# EAGLE design circuit (EAGLE 9.6.2)
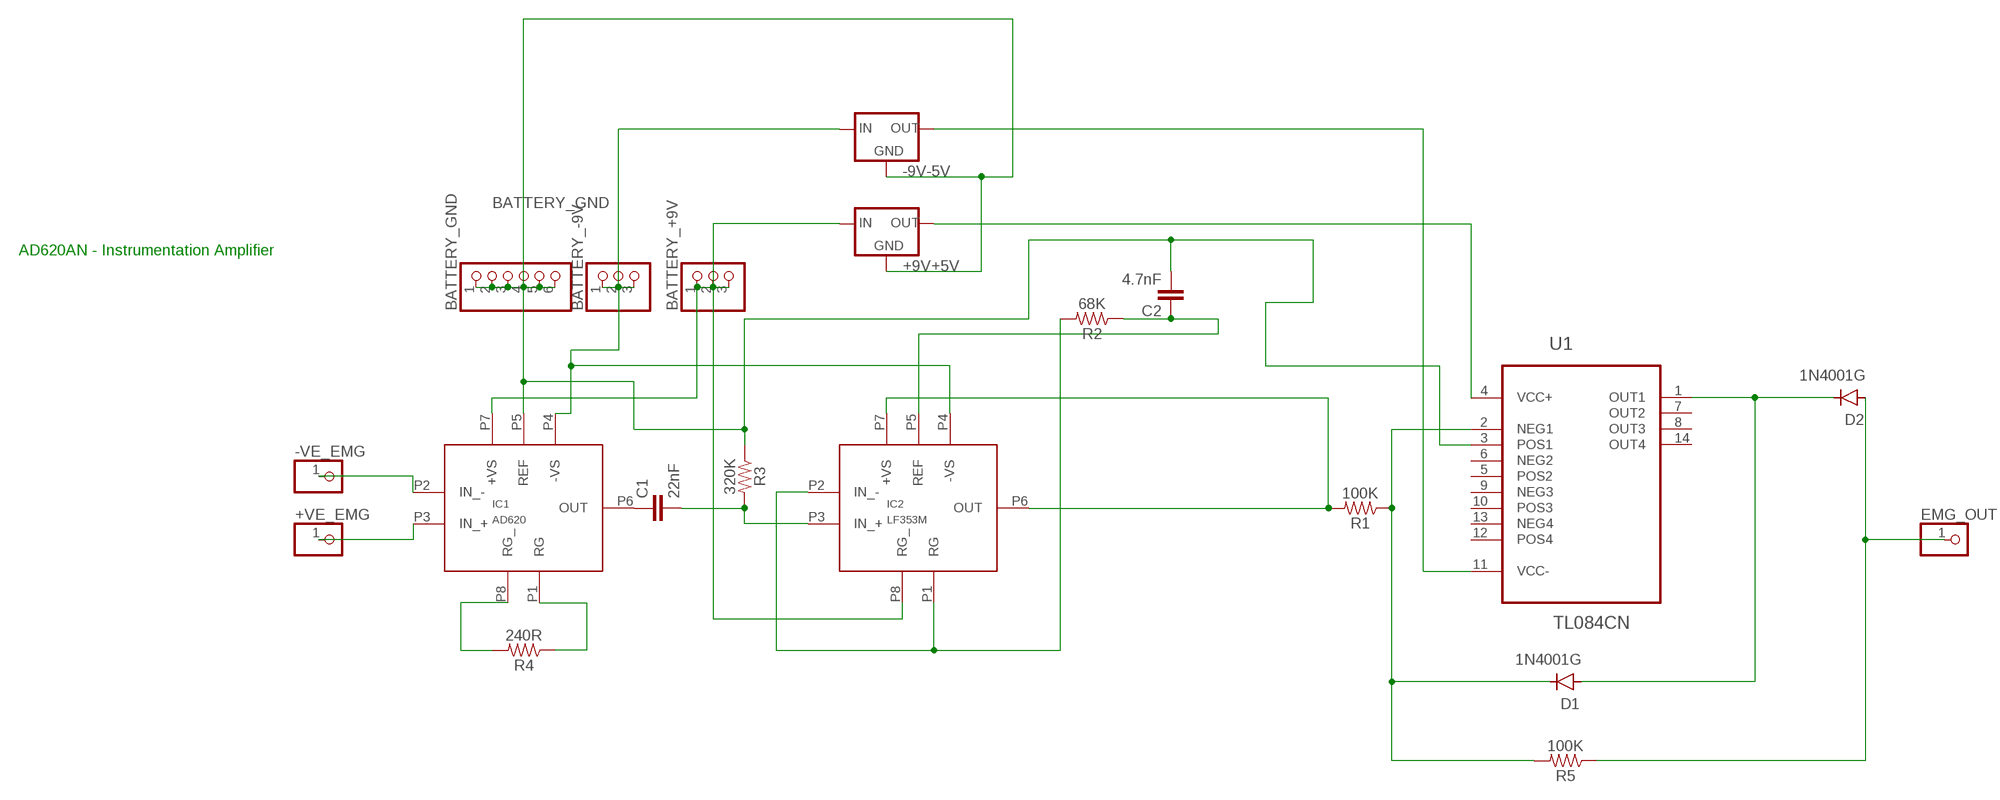
[diagram p0: schematic, sheet 1]

## Parts
+9V+5V  78XXL  [78XXL]
+VE_EMG  PINHD-1X1  [1X01]
-9V-5V  78XXL  [78XXL]
-VE_EMG  PINHD-1X1  [1X01]
BATTERY_+9V  PINHD-1X3  [1X03]
BATTERY_-9V  PINHD-1X3  [1X03]
BATTERY_GND  PINHD-1X6  [1X06]
C1  22nF  10NF-PTH-10MM-10000V-1-%  [CAP-PTH-10MM]
C2  4.7nF  10NF-PTH-10MM-10000V-1-%  [CAP-PTH-10MM]
D1  1N4001G  1N4004  [DO-41]
D2  1N4001G  1N4004  [DO-41]
EMG_OUT  PINHD-1X1  [1X01]
IC1  AD620  [DIL8]
IC2  LF353M  AD620  [DIL8]
R1  100K  10MOHM-HORIZ-1/4W-5%  [AXIAL-0.3]
R2  68K  10MOHM-HORIZ-1/4W-5%  [AXIAL-0.3]
R3  320K  10MOHM-HORIZ-1/4W-5%  [AXIAL-0.3]
R4  240R  10MOHM-HORIZ-1/4W-5%  [AXIAL-0.3]
R5  100K  10MOHM-HORIZ-1/4W-5%  [AXIAL-0.3]
U1  TL084CN  [DIP254P762X510-14]

## Nets
BATTERY_GND: +9V+5V.GND -9V-5V.GND BATTERY_GND.1 BATTERY_GND.2 BATTERY_GND.3 BATTERY_GND.4 BATTERY_GND.5 BATTERY_GND.6 C2.2 IC1.P5(REF) R3.P$1 U1.3(POS1)
N$1: IC1.P8(RG_) R4.P$2
N$2: IC1.P1(RG) R4.P$1
N$3: +VE_EMG.1 IC1.P3(IN_+)
N$4: -VE_EMG.1 IC1.P2(IN_-)
N$5: +9V+5V.IN BATTERY_+9V.1 BATTERY_+9V.2 BATTERY_+9V.3 IC1.P7(+VS) IC2.P8(RG_)
N$6: C1.1 IC1.P6(OUT)
N$7: D1.C R1.P$1 R5.P$2 U1.2(NEG1)
N$8: C1.2 IC2.P3(IN_+) R3.P$2
N$9: IC2.P1(RG) IC2.P2(IN_-) R2.P$2
N$10: C2.1 IC2.P5(REF) R2.P$1
N$11: IC2.P6(OUT) IC2.P7(+VS) R1.P$2
N$12: D1.A D2.C U1.1(OUT1)
N$13: +9V+5V.OUT U1.4(VCC+)
N$14: -9V-5V.OUT U1.11(VCC-)
N$15: D2.A EMG_OUT.1 R5.P$1
N$99: -9V-5V.IN BATTERY_-9V.1 BATTERY_-9V.2 BATTERY_-9V.3 IC1.P4(-VS) IC2.P4(-VS)
Unconnected: U1.5(POS2) U1.6(NEG2) U1.7(OUT2) U1.8(OUT3) U1.9(NEG3) U1.10(POS3) U1.12(POS4) U1.13(NEG4) U1.14(OUT4)

## Notes on the sheet
- AD620AN - Instrumentation Amplifier

## Library data of the parts
+9V+5V -9V-5V = v-reg-2:78XXL: VOLTAGE REGULATOR
+VE_EMG -VE_EMG EMG_OUT = adafruit:PINHD-1X1: Pin header 1x1 for 0.1" spacing With round pins
BATTERY_+9V BATTERY_-9V = adafruit:PINHD-1X3: PIN HEADER
BATTERY_GND = adafruit:PINHD-1X6: PIN HEADER
C1 C2 = SparkFun-Capacitors:10NF: 0.01uF/10nF/10,000pF ceramic capacitors A capacitor is a passive two-terminal electrical component used to store electrical energy temporarily in an electric field. CAP-09321; PROD_ID: CAP-09321; VALUE: 10nF
D1 D2 = Diodes:1N4004: DIODE GEN PURP 400V 1A DO41 Manufacturer's datasheet <https://www.mccsemi.com/pdf/Products/1N4001-1N4007(DO-41).pdf>; CREATED_BY: PCBLayout.com; DIGIKEY_PART_NUMBER: 1N4004MSCT-ND; MANUFACTURER: Micro Commercial Co; MPN: 1N4004; PACKAGE: DO-41
IC1 IC2 = ad620:AD620
R1-R5 = SparkFun-Resistors:10MOHM: RES-09327; PROD_ID: RES-09327; VALUE: 10M
U1 = TL084CN:TL084CN: JFET quad operational amplifiers Check prices <https://pricing.snapeda.com/parts/TL084CN/STMicroelectronics/view-part?ref=eda>; AVAILABILITY: Warning; DESCRIPTION: J-FET Amplifier 4 Circuit 14-DIP; MF: STMicroelectronics; MP: TL084CN; PACKAGE: DIP-14 STMicroelectronics; PRICE: None; PURCHASE-URL: https://pricing.snapeda.com/search/part/TL084CN/?ref=eda

## Board
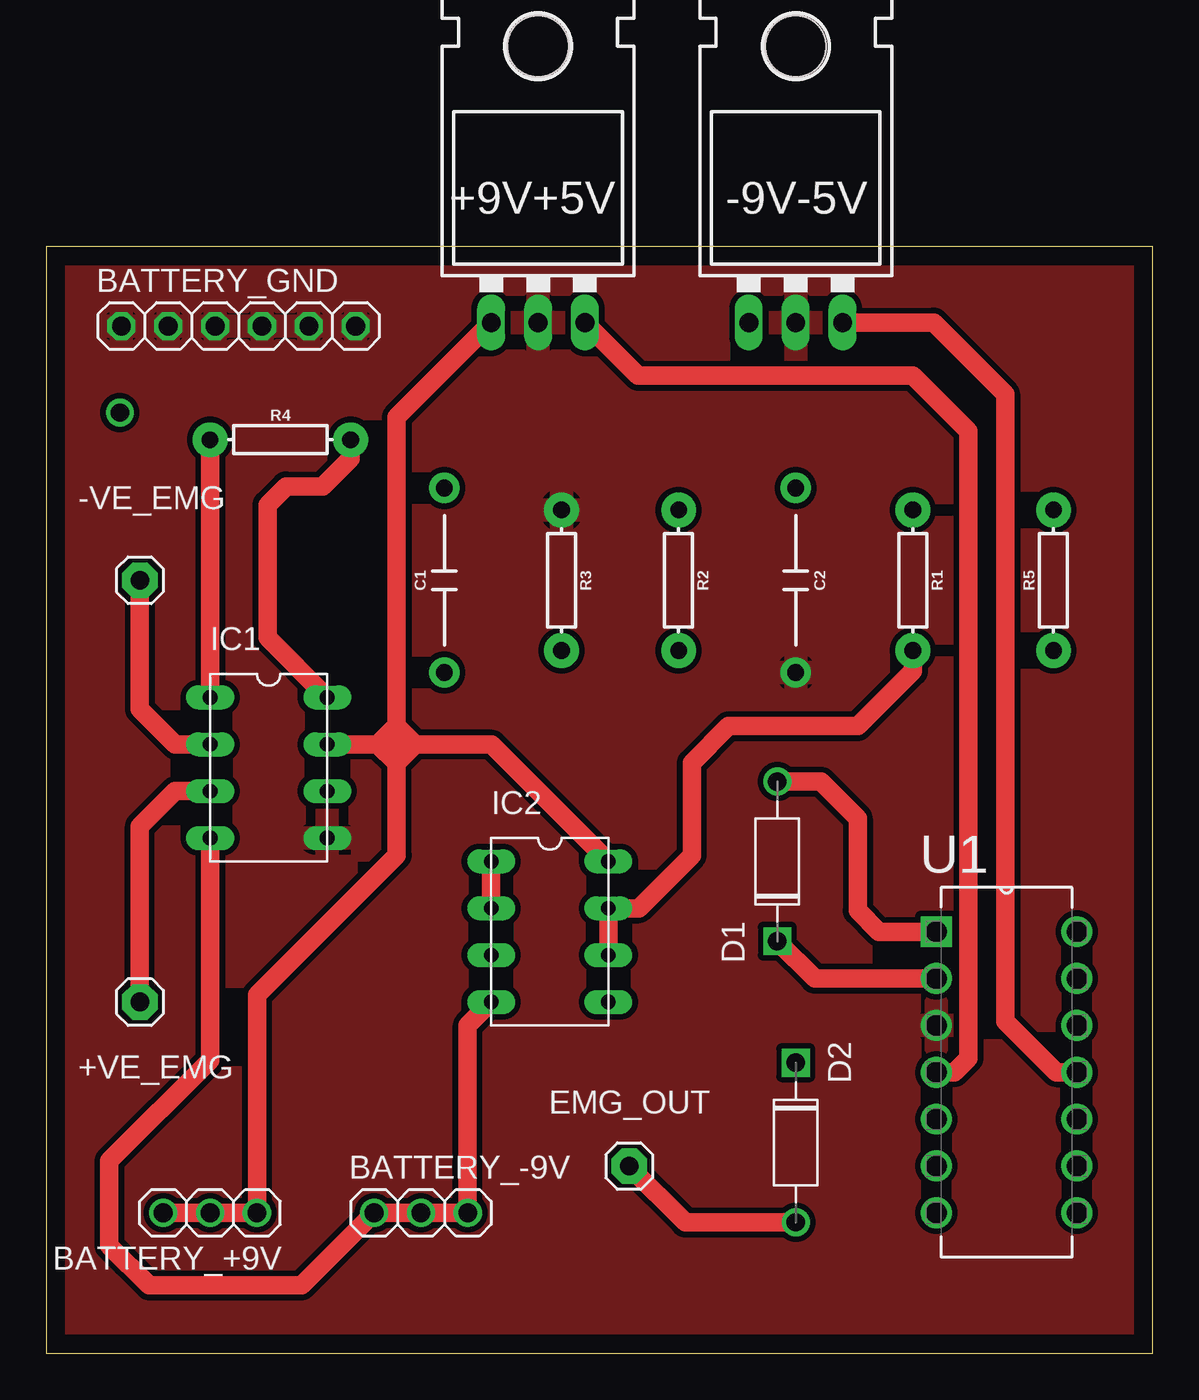
[diagram p1: board, top side]
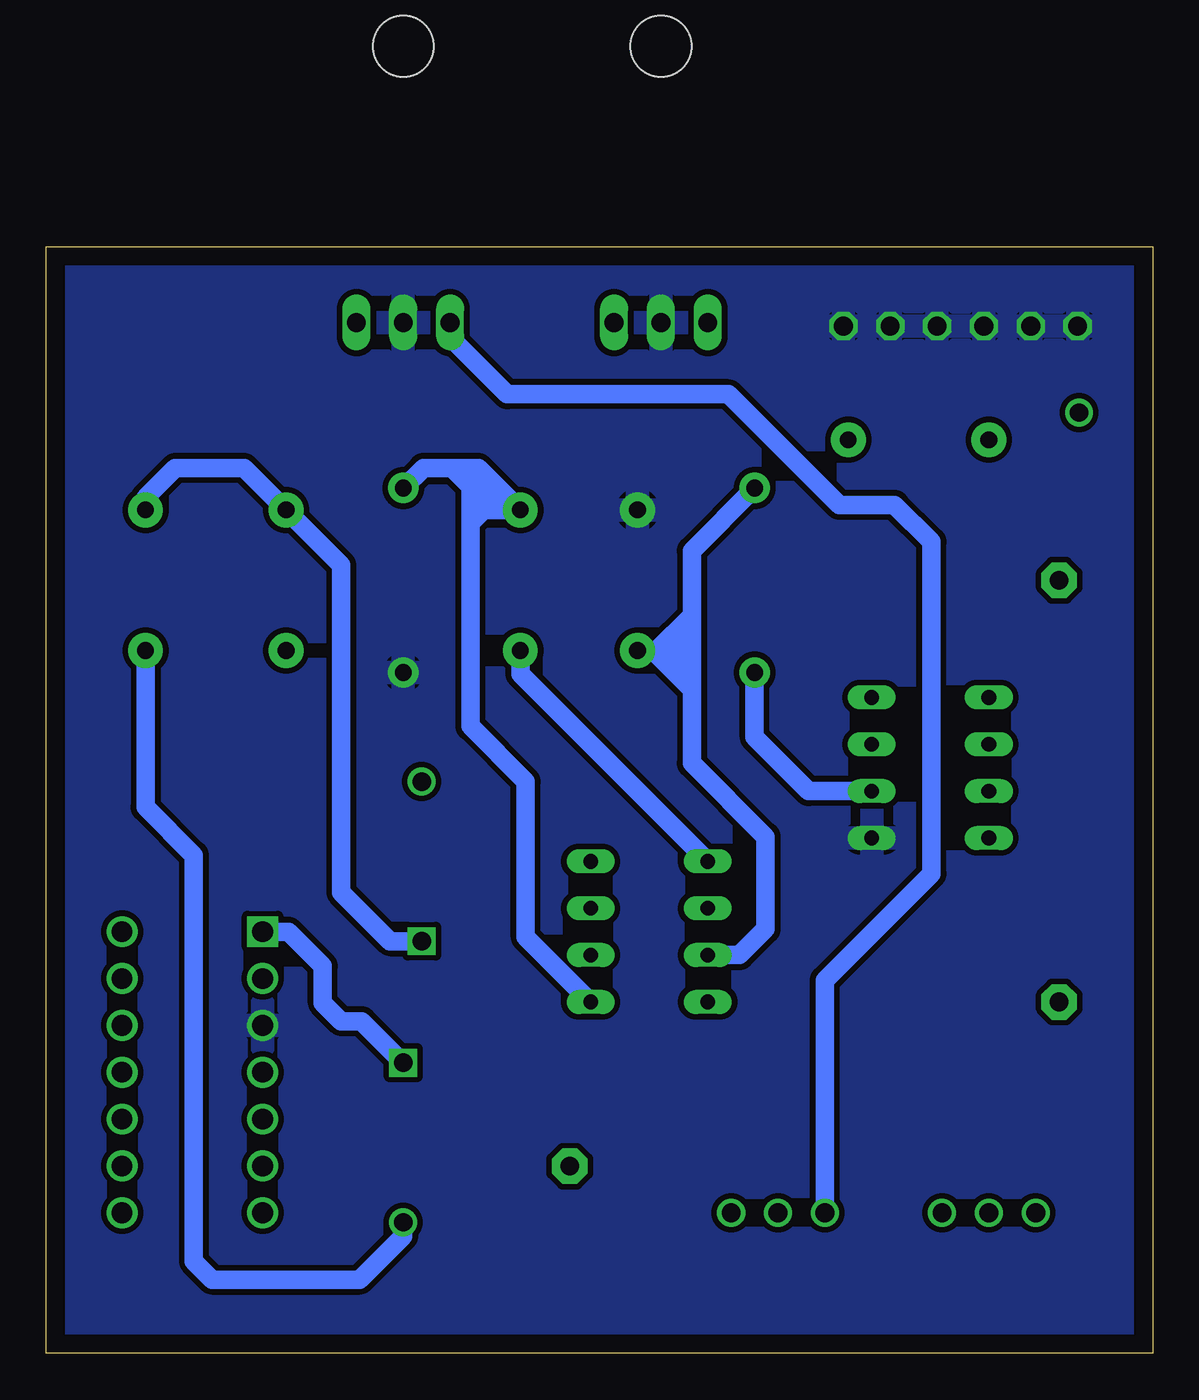
[diagram p2: board, bottom side, seen from below]

Size 60 x 60 mm. Coordinates in mm from the lower left corner, seen from the top.
Outline: 0,0 60,0 60,60 0,60 0,0
Copper layers (1*16): Top 0.035mm / dielectric 1.5mm / Bottom 0.035mm
Design rules "default *": minimum track width 6mil, minimum drill 0.35mm, track to track 6mil, track to pad 6mil, pad to pad 6mil, via to via 6mil, smd to smd 30mil, copper to edge 40mil, drill to drill 6mil, minimum pad ring 10mil, minimum via ring 8mil, stop-mask expansion 4mil, vias tented up to drill 0mil, thermal gap 10mil

### Footprints (pad centres in the part's own frame; a part is rotated, then mirrored left to right if it is on the bottom)
78XXL = drill 1.016 long: GND 0,-3.81; IN -2.54,-3.81; OUT 2.54,-3.81 | hole 3.302: 0,11.176
1X01 = drill 1.016 pad 1.93 octagon: 1 0,0
1X03 = drill 1.016: 1 -2.54,0; 2 0,0; 3 2.54,0
1X06 = drill 1.016 octagon: 1 -6.35,0; 2 -3.81,0; 3 -1.27,0; 4 1.27,0; 5 3.81,0; 6 6.35,0
CAP-PTH-10MM = drill 0.9 pad 1.651: 1 -5,0; 2 5,0
DO-41 = drill 1: A 4.325,0 | drill 1 square: C -4.325,0
DIL8 = drill 0.8 long: P1 -3.81,2.54; P2 -1.27,2.54; P3 1.27,2.54; P4 3.81,2.54; P5 3.81,8.89; P6 1.27,8.89; P7 -1.27,8.89; P8 -3.81,8.89
AXIAL-0.3 = drill 0.9 pad 1.88: P$1 -3.81,0; P$2 3.81,0
DIP254P762X510-14 = drill 1.118 square: 1 -7.62,15.24 | drill 1.118: 2 -7.62,12.7; 3 -7.62,10.16; 4 -7.62,7.62; 5 -7.62,5.08; 6 -7.62,2.54; 7 -7.62,0; 8 0,0; 9 0,2.54; 10 0,5.08; 11 0,7.62; 12 0,10.16; 13 0,12.7; 14 0,15.24

### Placement (x,y rotation side)
+9V+5V  26.67,59.69 0 top
+VE_EMG  5.08,19.05 0 top
-9V-5V  40.64,59.69 0 top
-VE_EMG  5.08,41.91 0 top
BATTERY_+9V  8.89,7.62 180 top
BATTERY_-9V  20.32,7.62 0 top
BATTERY_GND  10.43,55.69 0 top
C1  21.59,41.91 90 top
C2  40.64,41.91 270 top
D1  39.64,26.67 90 top
D2  40.64,11.43 270 top
EMG_OUT  31.61,10.15 0 top
IC1  6.35,31.75 270 top
IC2  21.59,22.86 270 top
R1  46.99,41.91 270 top
R2  34.29,41.91 270 top
R3  27.94,41.91 270 top
R4  12.7,49.53 0 top
R5  54.61,41.91 90 top
U1  55.88,7.62 0 top

### Tracks (layer width: path | path; a pad name or v marks a point on that pad's centre or on a via)
BATTERY_GND
  pour Bottom (isolate 0.305): 1,59 1,1 59,1 59,59
  pour Top (isolate 0.305): 1,59 1,1 59,1 59,59
N$1
  Top 1.016: IC1.P8 12,38.8 12,46 13,47 15,47 16.51,48.51 R4.P$2
N$2
  Top 1.016: R4.P$1 IC1.P1
N$3
  Top 1.016: +VE_EMG.1 5.08,28.57 6.99,30.48 IC1.P3
N$4
  Top 1.016: -VE_EMG.1 5.08,34.92 7,33 8.87,33 IC1.P2
N$5
  Top 1.016: 19,32 19,27 11.43,19.43 BATTERY_+9V.1 BATTERY_+9V.2 BATTERY_+9V.3 | 19,32 17.98,33.02 | 17.98,33.02 IC1.P7 | +9V+5V.IN 19,50.75 19,34 | 19,34 19,33 | 19,33 19,32 | 17.98,33.02 18.96,34 19,34 | IC2.P8 24.15,33 20,33 | 20,33 19,33 | 19,34 20,33 | 20,33 19,32
N$6
  Bottom 1.016: IC1.P6 18.67,30.48 21.59,33.4 C1.1
N$7
  Top 1.016: D1.C 41.66,20.32 U1.2
  Bottom 1.016: R5.P$2 54.61,46.39 53,48 49.27,48 R1.P$1 44,42.73 44,25 41.34,22.34 D1.C
N$8
  Bottom 1.016: C1.2 25,43.5 25,40 | 25,40 26.9,38.1 | 26.9,38.1 R3.P$2 | 25,40 25,39 | 25,39 25,36 | 25,36 25,32 21,28 21,23 22.41,21.59 IC2.P3 | 26.9,38.1 26.9,37.9 26,37 | 26,37 25,36 | 26.9,38.1 26.8,38 26,38 | 26,38 25,39 | 26,37 26,38
N$9
  Top 1.016: IC2.P1 IC2.P2
  Bottom 1.016: IC2.P1 34.29,36.83 R2.P$2
N$10
  Bottom 1.016: 36.57,48 R2.P$1 36.28,45.72 | C2.1 39.55,48 38,48 | 36.57,48 38,48 | IC2.P5 34,22.57 34,31 37,34 37,45 | 37,45 36.28,45.72 | 37,45 37,47 | 37,47 37,47.57 36.57,48 | 37,47 38,48 | 37,47 36,47 36,46 36.28,45.72
N$11
  Top 1.016: IC2.P6 IC2.P7 32.13,24.13 35,27 35,32 37,34 44,34 46.99,36.99 R1.P$2
N$12
  Top 1.016: D1.A 42.01,31 44,29 44,24 45.14,22.86 U1.1
  Bottom 1.016: D2.C 42.88,18 44,18 45,19 45,21 46.86,22.86 U1.1
N$13
  Top 1.016: +9V+5V.OUT 32.09,53 47,53 50,50 50,16 49.24,15.24 U1.4
N$14
  Top 1.016: -9V-5V.OUT 48.12,55.88 52,52 52,18 54.76,15.24 U1.11
N$15
  Top 1.016: EMG_OUT.1 34.66,7.11 D2.A
  Bottom 1.016: R5.P$1 54.61,29.61 52,27 52,5 51,4 43,4 40.64,6.36 D2.A
N$16  (via drill 1)
  other vias: 4,51
N$99
  Top 1.016: IC2.P4 22.86,17.78 BATTERY_-9V.3 BATTERY_-9V.2 BATTERY_-9V.1 13.84,3.68 5.59,3.68 3.43,5.84 3.43,10.43 8.89,15.89 IC1.P4
  Bottom 1.016: BATTERY_-9V.1 17.78,20.22 12,26 12,44 14,46 17,46 23,52 35,52 38.1,55.1 -9V-5V.IN